# Altium schematic sheet LED.SchDoc
size A
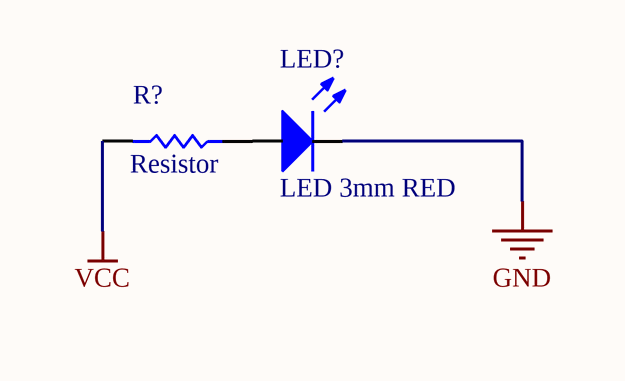
[diagram p0: LED.SchDoc]

## Parts
LED?  LED 3mm RED  [LED 3mm Red]
R?  Resistor  [Resistor]

## Nets
GND: LED?.2(-)
VCC: R?.1
NetLED?_1: LED?.1(+) R?.2